# EAGLE design espstack (EAGLE 6.5.0)
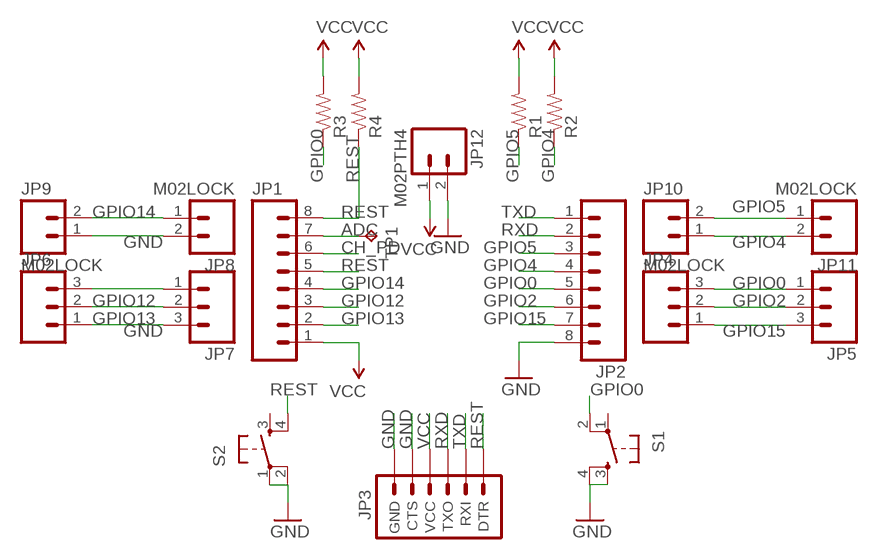
[diagram p0: schematic, sheet 1]

## Parts
JP1  M08LOCK_LONGPADS  [1X08_LOCK_LONGPADS]
JP2  M08LOCK_LONGPADS  [1X08_LOCK_LONGPADS]
JP3  ARDUINO_SERIAL_PROGRAMLOCK  [1X06_LOCK]
JP4  M03LOCK  [1X03_LOCK]
JP5  M03LOCK  [1X03_LOCK]
JP6  M03LOCK  [1X03_LOCK]
JP7  M03LOCK  [1X03_LOCK]
JP8  M02LOCK  [1X02_LOCK]
JP9  M02LOCK  [1X02_LOCK]
JP10  M02LOCK  [1X02_LOCK]
JP11  M02LOCK  [1X02_LOCK]
JP12  M02PTH4  [1X02_XTRA_BIG]
R1  RESISTOR0805-RES  [0805]
R2  RESISTOR0805-RES  [0805]
R3  RESISTOR0805-RES  [0805]
R4  RESISTOR0805-RES  [0805]
S1  TAC_SWITCHPTH  [TACTILE-PTH]
S2  TAC_SWITCHPTH  [TACTILE-PTH]
TP1  TPB2,54  [B2,54]

## Nets
ADC: JP1.7 TP1.TP
CH_PD: JP1.6
GND: JP2.8 JP3.5(CTS) JP3.6(GND) JP6.1 JP7.3 JP8.2 JP9.1 JP12.2 S1.3 S1.4 S2.1 S2.2
GPIO0: JP2.5 JP4.3 JP5.1 R3.1 S1.2
GPIO2: JP2.6 JP4.2 JP5.2
GPIO4: JP2.4 JP10.1 JP11.2 R2.1
GPIO5: JP2.3 JP10.2 JP11.1 R1.1
GPIO12: JP1.3 JP6.3 JP7.1
GPIO13: JP1.2 JP6.2 JP7.2
GPIO14: JP1.4 JP8.1 JP9.2
GPIO15: JP2.7 JP4.1 JP5.3
REST: JP1.5 JP1.8 JP3.1(DTR) R4.1 S2.4
RXD: JP2.2 JP3.3(TXO)
TXD: JP2.1 JP3.2(RXI)
VCC: JP1.1 JP3.4(VCC) JP12.1 R1.2 R2.2 R3.2 R4.2
Unconnected: S1.1 S2.3

## Library data of the parts
JP1 JP2 = SparkFun-Connectors:M08: Header 8 Standard 8-pin 0.1" header. Use with straight break away headers (SKU : PRT-00116), right angle break away headers (PRT-00553), swiss pins (PRT-00743), machine pins (PRT-00117), and female headers (PRT-00115).
JP3 = SparkFun-Connectors:ARDUINO_SERIAL_PROGRAM: FTDI connector footprints
JP4-JP7 = SparkFun-Connectors:M03: Header 3 Standard 3-pin 0.1" header. Use with straight break away headers (SKU : PRT-00116), right angle break away headers (PRT-00553), swiss pins (PRT-00743), machine pins (PRT-00117), and female headers (PRT-00115). Molex polarized connector foot print use with SKU : PRT-08232 with associated crimp pins and housings.
JP8-JP12 = SparkFun-Connectors:M02: Standard 2-pin 0.1" header. Use with - straight break away headers ( PRT-00116) - right angle break away headers (PRT-00553) - swiss pins (PRT-00743) - machine pins (PRT-00117) - female headers (PRT-00115) Molex polarized connector foot print use with: PRT-08233 with associated crimp pins and housings. 2.54_SCREWTERM for use with PRT-10571. 3.5mm Screw Terminal footprints for PRT-08084 5mm Screw Terminal footprints for use with PRT-08433
R1-R4 = SparkFun-Passives:RESISTOR: Resistor Basic schematic elements and footprints for 0603, 1206, and PTH resistors.
S1 S2 = SparkFun-Electromechanical:TAC_SWITCH: Momentary Switch Button commonly used for reset or general input. Spark Fun Electronics SKU : COM-00097 SMT- SWCH-08247
TP1 = testpad:TP: Test pad

## Board
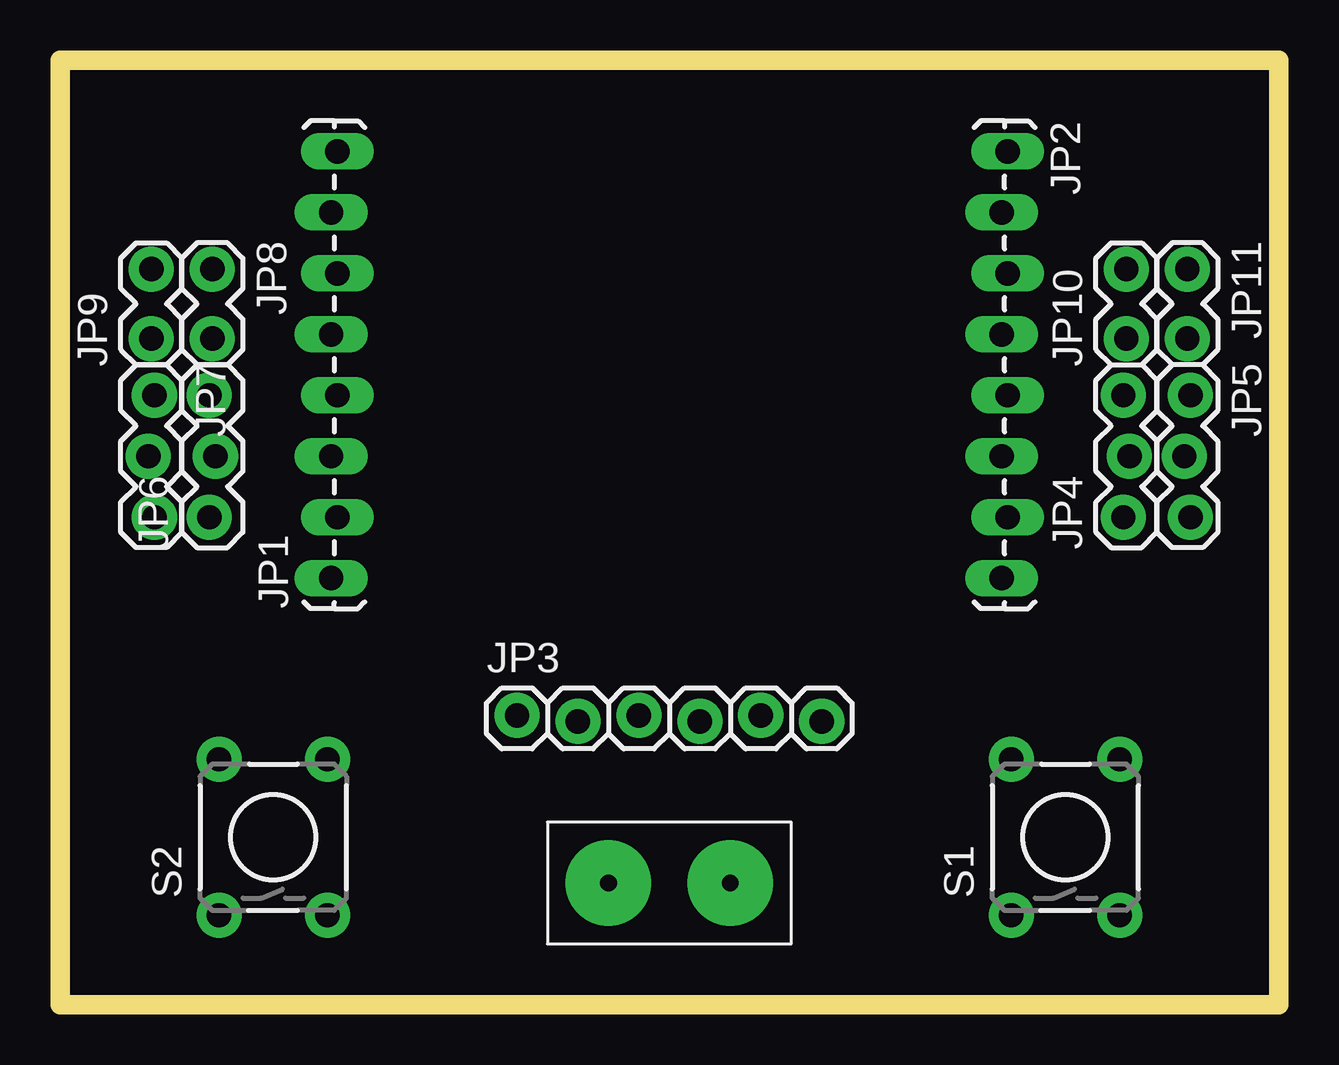
[diagram p1: board, top side]
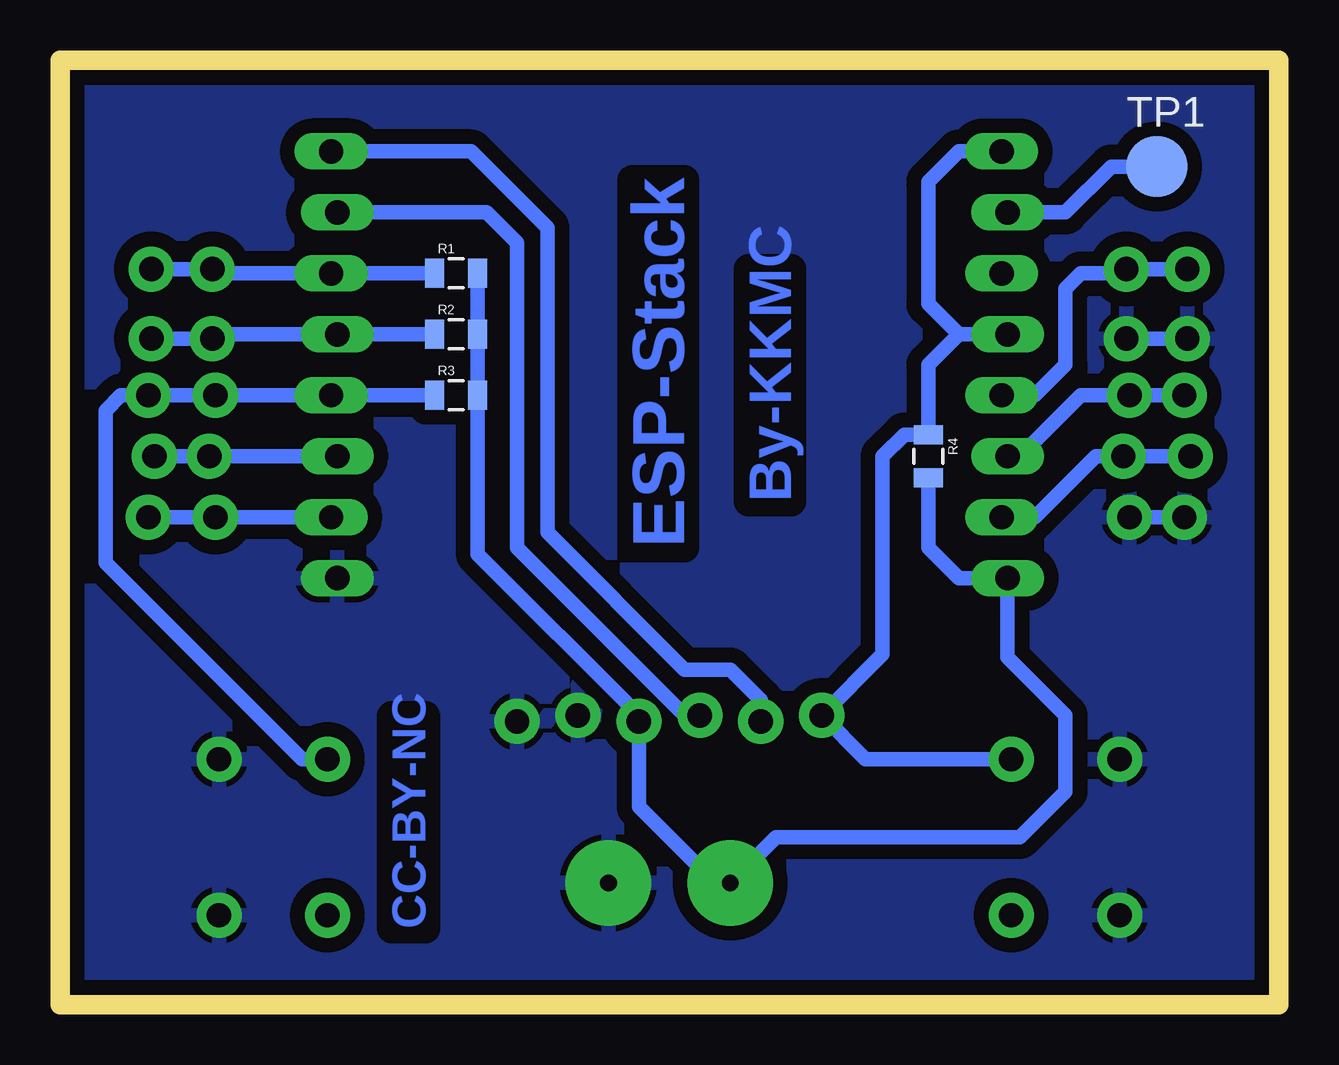
[diagram p2: board, bottom side, seen from below]

Size 50.8 x 39.37 mm. Coordinates in mm from the lower left corner, seen from the top.
Outline: 0,0 50.8,0 50.8,39.37 0,39.37 0,0
Copper layers (1*16): Top 0.035mm / dielectric 1.5mm / Bottom 0.035mm
Design rules "default": minimum track width 10mil, minimum drill 24mil, track to track 8mil, track to pad 8mil, pad to pad 8mil, via to via 8mil, smd to smd 8mil, copper to edge 40mil, drill to drill 8mil, minimum pad ring 10mil, minimum via ring 8mil, stop-mask expansion 4mil, vias tented up to drill 0mil, thermal gap 10mil
Milling: 4 lines

### Footprints (pad centres in the part's own frame; a part is rotated, then mirrored left to right if it is on the bottom)
1X08_LOCK_LONGPADS = drill 1.016 long: 1 0,0.127; 2 2.54,-0.127; 3 5.08,0.127; 4 7.62,-0.127; 5 10.16,0.127; 6 12.7,-0.127; 7 15.24,0.127; 8 17.78,-0.127
1X06_LOCK = drill 1.016 pad 1.88: 1 0,0; 2 2.54,-0.254; 3 5.08,0; 4 7.62,-0.254; 5 10.16,0; 6 12.7,-0.254
1X03_LOCK = drill 1.016 pad 1.88: 1 0,0.127; 2 2.54,-0.127; 3 5.08,0.127
1X02_LOCK = drill 1.016 pad 1.88: 1 -0.178,0; 2 2.718,0
1X02_XTRA_BIG = drill 0.7 pad 3.556: 1 -2.54,0; 2 2.54,0
0805 = smd 0.8 x 1.2: 1 -0.9,0; 2 0.9,0
TACTILE-PTH = drill 1.016 pad 1.88: 1 -3.251,2.261; 2 3.251,2.261; 3 -3.251,-2.261; 4 3.251,-2.261
B2,54 = smd 2.54 x 2.54: TP 0,0

### Placement (x,y rotation side)
JP1  11.43,17.78 90 top
JP2  39.37,35.56 270 top
JP3  19.05,12.07 0 top
JP4  44.45,20.32 90 top
JP5  46.99,25.4 270 top
JP6  6.35,20.32 90 top
JP7  3.81,25.4 270 top
JP8  6.35,30.48 270 top
JP9  3.81,27.94 90 top
JP10  44.45,27.94 90 top
JP11  46.99,30.48 270 top
JP12  25.4,5.08 0 top
R1  34.29,30.48 0 bottom
R2  34.29,27.94 0 bottom
R3  34.29,25.4 0 bottom
R4  14.61,22.86 270 bottom
S1  41.91,6.98 90 top
S2  8.89,6.98 90 top
TP1  5.08,34.92 0 bottom
U$3  [A4-35SC]  -3.17,-4.45 0 top  (outside the outline)

### Tracks (layer width: path | path; a pad name or v marks a point on that pad's centre or on a via)
ADC
  Bottom 0.61: JP1.7 8.89,33.02 6.99,34.92 TP1.TP
GND
  Bottom 0.61: JP8.2 JP9.1 | JP7.3 JP6.1
  pour Bottom (isolate 0.61): 0,39.37 50.8,39.37 50.8,0 0,0
GPIO0
  Bottom 0.61: R3.1 JP2.5 JP4.3 JP5.1 48.26,25.4 48.9,24.77 48.9,18.41 40.72,10.24 S1.2
GPIO2
  Bottom 0.61: JP5.2 JP4.2 JP2.6
GPIO4
  Bottom 0.61: JP11.2 JP10.1 44.27,27.94 JP2.4 R2.1
GPIO5
  Bottom 0.61: JP11.1 JP10.2 44.27,30.48 JP2.3 R1.1
GPIO12
  Bottom 0.61: JP1.3 10.8,22.86 8.25,25.4 JP6.3 JP7.1
GPIO13
  Bottom 0.61: JP7.2 JP6.2 7.62,22.86 10.16,20.32 JP1.2
GPIO14
  Bottom 0.61: JP1.4 10.16,25.4 8.89,26.67 8.89,29.84 8.25,30.48 6.53,30.48 JP8.1 JP9.2
GPIO15
  Bottom 0.61: JP5.3 JP4.1 JP2.7
REST
  Bottom 0.61: JP1.8 13.34,35.56 14.61,34.29 14.61,29.21 13.34,27.94 | 13.34,27.94 JP1.5 | S2.4 17.22,10.24 JP3.1 16.51,14.61 16.51,22.86 15.61,23.76 R4.1 14.61,26.67 13.34,27.94
RXD
  Bottom 0.61: JP3.3 24.77,12.07 31.75,19.05 31.75,31.75 33.02,33.02 JP2.2
TXD
  Bottom 0.61: JP3.2 21.59,12.7 22.86,13.97 24.77,13.97 30.48,19.68 30.48,32.38 33.66,35.56 JP2.1
VCC
  Bottom 0.61: R1.2 R2.2 R3.2 33.39,18.79 26.67,12.07 JP3.4 26.67,8.25 23.5,5.08 JP12.1 20.95,6.98 10.8,6.98 8.89,8.89 8.89,12.07 11.3,14.48 JP1.1 13.34,17.78 14.61,19.05 R4.2

### Text on the board
Bottom: By-KKMC | ESP-Stack | CC-BY-NC